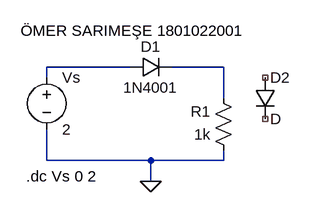
[diagram p0: schematic Draft7.asc]
Draft7.asc, the LTspice schematic file:
Version 4
SHEET 1 880 680
WIRE 128 32 0 32
WIRE 272 32 192 32
WIRE 0 48 0 32
WIRE 272 80 272 32
WIRE 0 176 0 128
WIRE 160 176 0 176
WIRE 272 176 272 160
WIRE 272 176 160 176
WIRE 160 208 160 176
FLAG 160 208 0
SYMBOL res 288 176 R180
WINDOW 0 36 76 Left 2
WINDOW 3 36 40 Left 2
SYMATTR InstName R1
SYMATTR Value 1k
SYMBOL diode 128 48 R270
WINDOW 0 32 32 VTop 2
WINDOW 3 0 32 VBottom 2
SYMATTR InstName D1
SYMATTR Value 1N4001
SYMBOL voltage 0 32 R0
WINDOW 123 0 0 Left 0
WINDOW 39 0 0 Left 0
SYMATTR InstName Vs
SYMATTR Value 2
SYMBOL diode 320 48 R0
SYMATTR InstName D2
TEXT -32 200 Left 2 !.dc Vs 0 2
TEXT -40 -24 Left 2 !ÖMER SARIMEŞE 1801022001

The netlist it stands for:
* Draft7.asc
R1 0 N002 1k
D1 N001 N002 1N4001
Vs N001 0 2
D2 NC_01 NC_02 D
.model D D
.lib standard.dio
.dc Vs 0 2
ÖMER SARIMEŞE 1801022001
.backanno
.end